# EAGLE design Pulsioximetro (EAGLE 6.4)
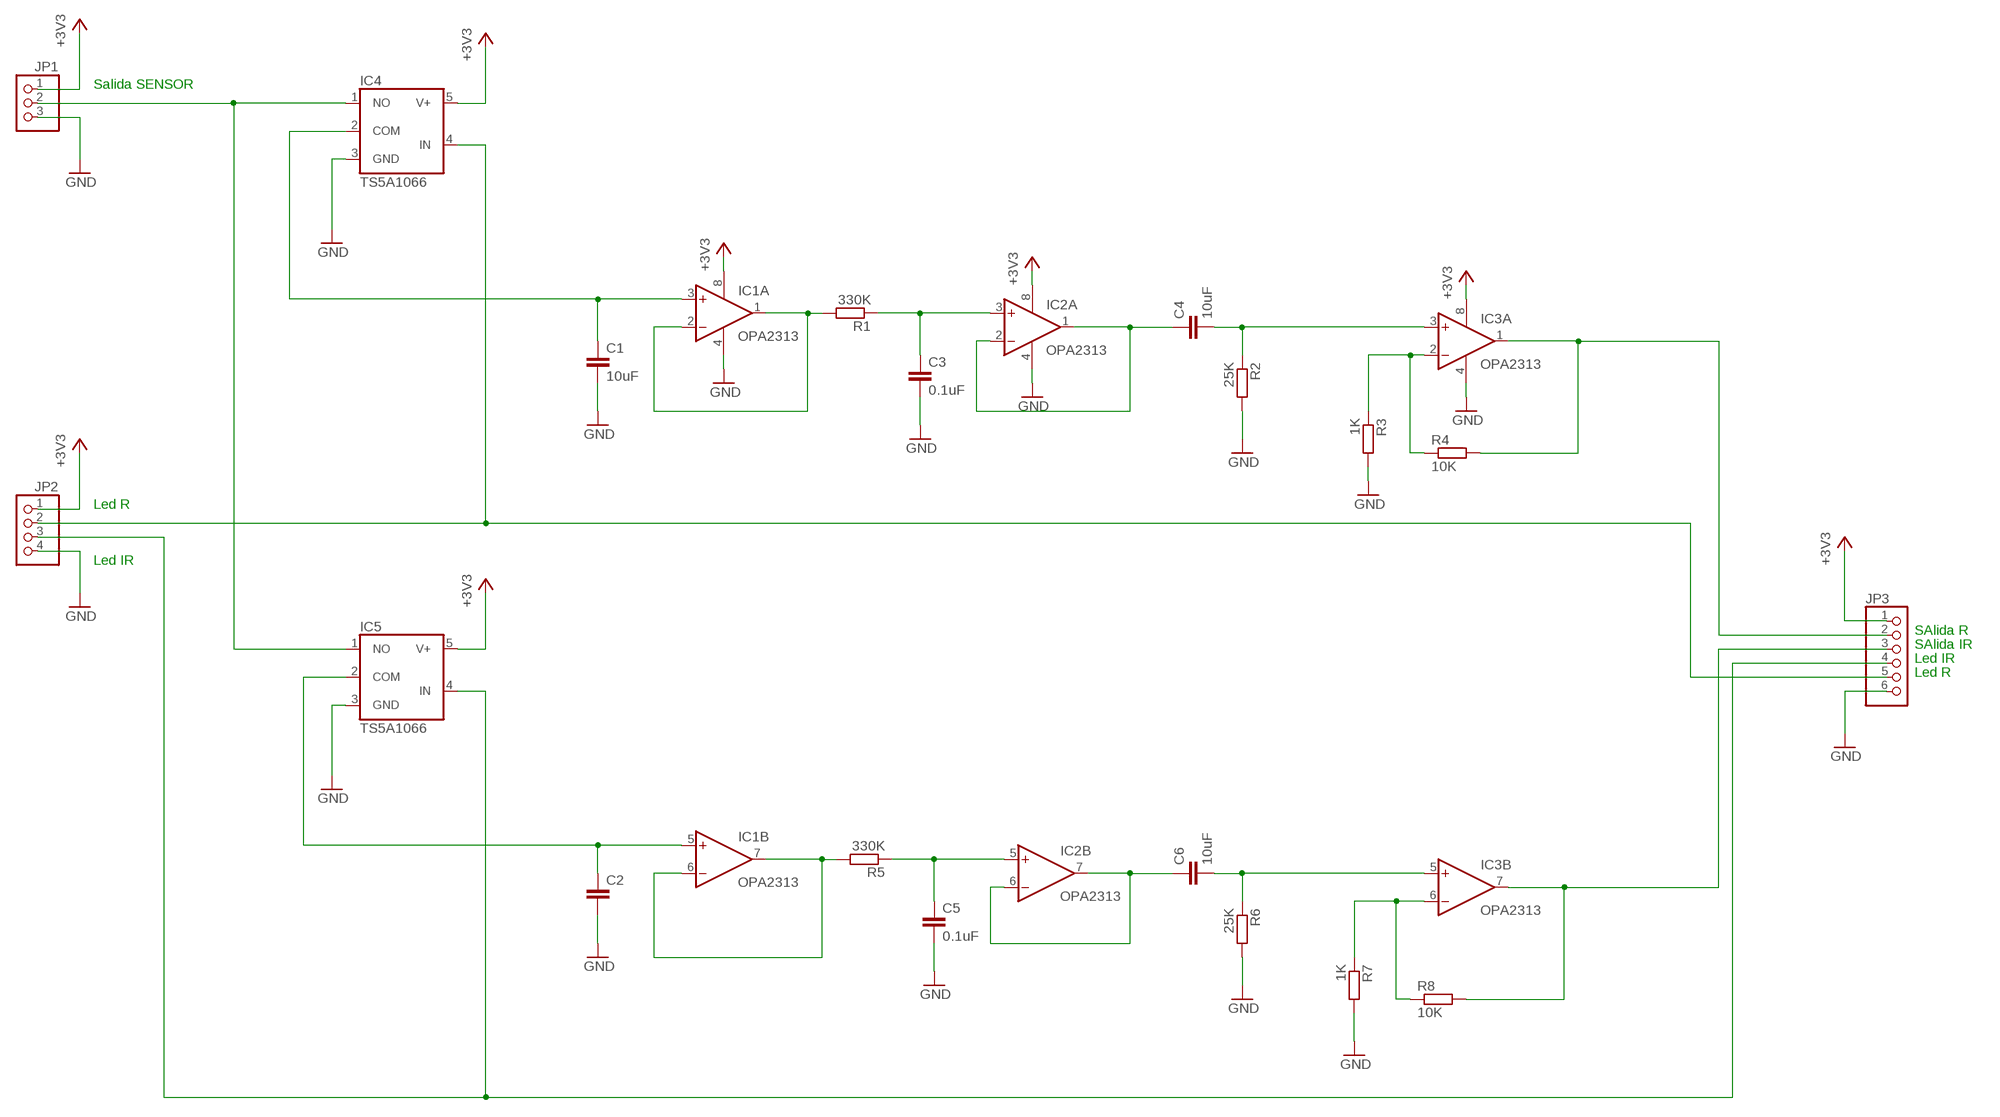
[diagram p0: schematic, sheet 1]

## Parts
C1  10uF  C-EU050-024X044  [C050-024X044]
C2  C-EU050-024X044  [C050-024X044]
C3  0.1uF  C-EU050-024X044  [C050-024X044]
C4  10uF  C-EU050-024X044  [C050-024X044]
C5  0.1uF  C-EU050-024X044  [C050-024X044]
C6  10uF  C-EU050-024X044  [C050-024X044]
IC1  OPA2313  TL082D  [SO08]
IC2  OPA2313  TL082D  [SO08]
IC3  OPA2313  TL082D  [SO08]
IC4  TS5A1066  TS520550  [SOT25]
IC5  TS5A1066  TS520550  [SOT25]
JP1  PINHD-1X3  [1X03]
JP2  PINHD-1X4  [1X04]
JP3  PINHD-1X6  [1X06]
R1  330K  R-EU_0207/10  [0207/10]
R2  25K  R-EU_0207/10  [0207/10]
R3  1K  R-EU_0207/10  [0207/10]
R4  10K  R-EU_0207/10  [0207/10]
R5  330K  R-EU_0207/10  [0207/10]
R6  25K  R-EU_0207/10  [0207/10]
R7  1K  R-EU_0207/10  [0207/10]
R8  10K  R-EU_0207/10  [0207/10]

## Nets
+3V3: IC1.8(P:V+) IC2.8(P:V+) IC3.8(P:V+) IC4.5(V+) IC5.5(V+) JP1.1 JP2.1 JP3.1
GND: C1.2 C2.2 C3.2 C5.2 IC1.4(P:V-) IC2.4(P:V-) IC3.4(P:V-) IC4.3(GND) IC5.3(GND) JP1.3 JP2.4 JP3.6 R2.2 R3.2 R6.2 R7.2
N$1: IC4.1(NO) IC5.1(NO) JP1.2
N$2: IC4.4(IN) JP2.2 JP3.5
N$3: IC5.4(IN) JP2.3 JP3.4
N$4: C1.1 IC1.3(A:+IN) IC4.2(COM)
N$5: C2.1 IC1.5(B:+IN) IC5.2(COM)
N$6: C3.1 IC2.3(A:+IN) R1.1
N$7: IC1.1(A:OUT) IC1.2(A:-IN) R1.2
N$9: C4.1 IC2.1(A:OUT) IC2.2(A:-IN)
N$10: C4.2 IC3.3(A:+IN) R2.1
N$11: IC3.2(A:-IN) R3.1 R4.1
N$12: IC3.1(A:OUT) JP3.2 R4.2
N$13: IC1.6(B:-IN) IC1.7(B:OUT) R5.2
N$14: C5.1 IC2.5(B:+IN) R5.1
N$16: C6.1 IC2.6(B:-IN) IC2.7(B:OUT)
N$18: C6.2 IC3.5(B:+IN) R6.1
N$19: IC3.6(B:-IN) R7.1 R8.1
N$20: IC3.7(B:OUT) JP3.3 R8.2

## Notes on the sheet
- Salida SENSOR
- Led R
- Led IR
- SAlida R
- SAlida IR
- Led IR
- Led R

## Library data of the parts
C1-C6 = rcl:C-EU: CAPACITOR, European symbol
IC1-IC3 = linear:TL082: OP AMP
IC4 IC5 = v-reg:TS5205: 150mA Low Noise LDO Voltage Regulator with Enable TSC [Taiwan Semiconductor Company, Ltd] Source: http://www.taiwansemi.com .. 5205_0409c.pdf
JP1 = pinhead:PINHD-1X3: PIN HEADER
JP2 = pinhead:PINHD-1X4: PIN HEADER
JP3 = pinhead:PINHD-1X6: PIN HEADER
R1-R8 = rcl:R-EU_: RESISTOR, European symbol

## Board
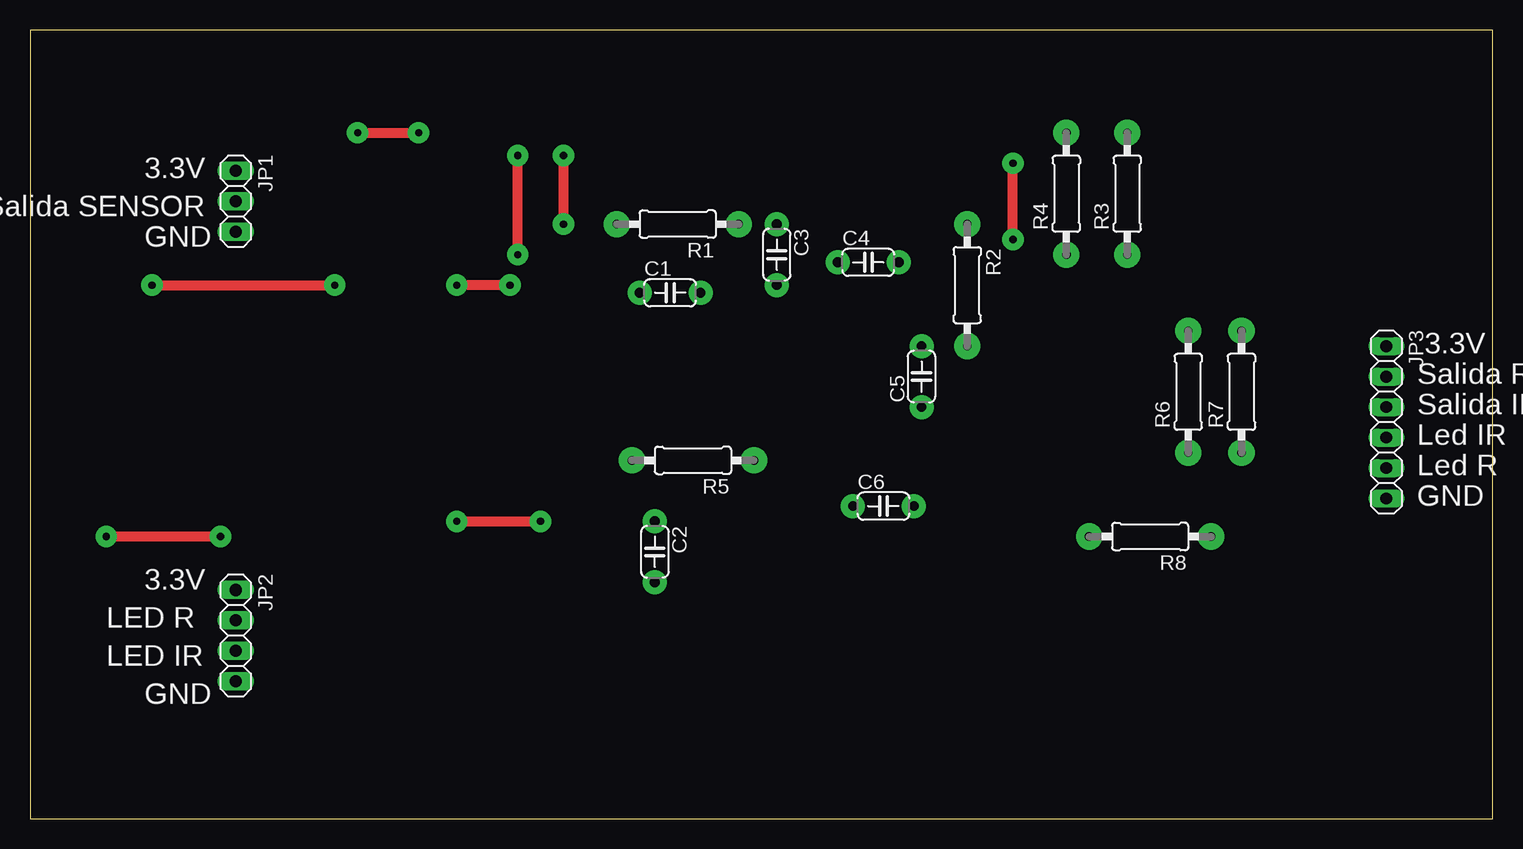
[diagram p1: board, top side]
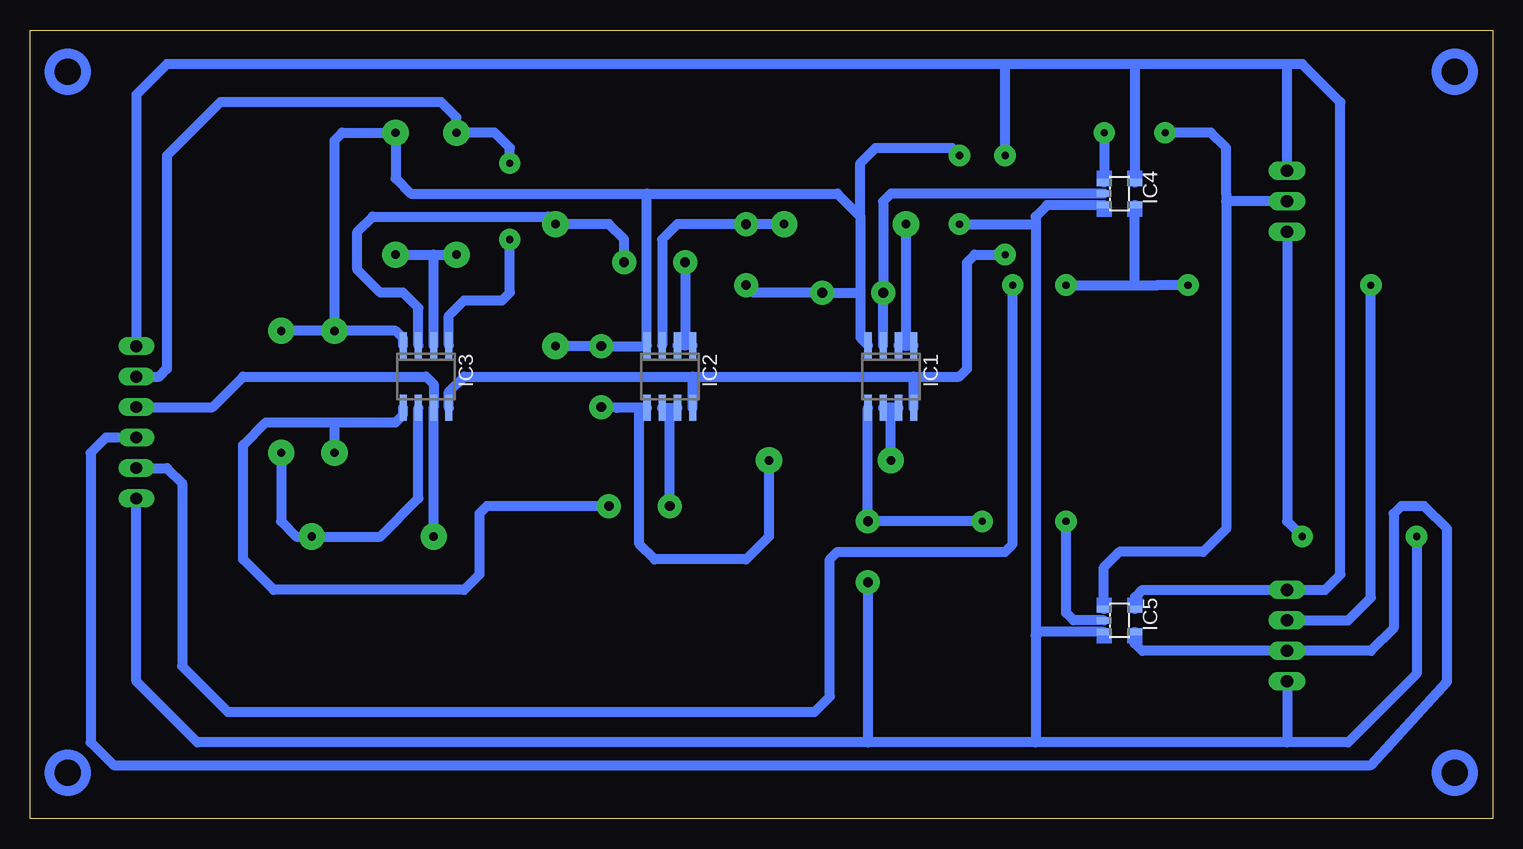
[diagram p2: board, bottom side, seen from below]

Size 121.9 x 65.71 mm. Coordinates in mm from the lower left corner, seen from the top.
Outline: 0,0 121.9,0 121.9,65.71 0,65.71 0,0
Copper layers (1*16): Top 0.035mm / dielectric 1.5mm / Bottom 0.035mm
Design rules "default": minimum track width 10mil, minimum drill 24mil, track to track 8mil, track to pad 8mil, pad to pad 8mil, via to via 8mil, smd to smd 8mil, copper to edge 40mil, drill to drill 8mil, minimum pad ring 10mil, minimum via ring 8mil, stop-mask expansion 4mil, vias tented up to drill 0mil, thermal gap 10mil

### Footprints (pad centres in the part's own frame; a part is rotated, then mirrored left to right if it is on the bottom)
C050-024X044 = drill 0.813 pad 2.007: 1 -2.54,0; 2 2.54,0
SO08 = smd 0.6 x 2.2: 1 -1.905,-2.6; 2 -0.635,-2.6; 3 0.635,-2.6; 4 1.905,-2.6; 5 1.905,2.6; 6 0.635,2.6; 7 -0.635,2.6; 8 -1.905,2.6
SOT25 = smd 0.55 x 1.2: 1 -0.95,-1.3; 2 0,-1.3; 3 0.95,-1.3; 4 0.95,1.3; 5 -0.95,1.3
1X03 = drill 1.016 long: 1 -2.54,0; 2 0,0; 3 2.54,0
1X04 = drill 1.016 long: 1 -3.81,0; 2 -1.27,0; 3 1.27,0; 4 3.81,0
1X06 = drill 0.991 long: 1 -6.35,0; 2 -3.81,0; 3 -1.27,0; 4 1.27,0; 5 3.81,0; 6 6.35,0
0207/10 = drill 0.7 pad 2.184: 1 -5.08,0; 2 5.08,0

### Placement (x,y rotation side)
C1  53.34,43.82 0 top
C2  52.07,22.23 270 top
C3  62.23,46.99 270 top
C4  69.85,46.36 0 top
C5  74.3,36.83 90 top
C6  71.12,26.04 0 top
IC1  50.16,36.83 180 bottom
IC2  68.58,36.83 180 bottom
IC3  88.9,36.83 180 bottom
IC4  31.11,52.07 270 bottom
IC5  31.11,16.51 270 bottom
JP1  17.14,51.44 270 top
JP2  17.14,15.24 270 top
JP3  113.03,33.02 270 top
R1  53.98,49.53 180 top
R2  78.11,44.45 270 top
R3  91.44,52.07 90 top
R4  86.36,52.07 90 top
R5  55.24,29.84 180 top
R6  96.52,35.56 90 top
R7  100.97,35.56 90 top
R8  93.34,23.5 180 top

### Tracks (layer width: path | path; a pad name or v marks a point on that pad's centre or on a via)
+3V3  (via drill 0.6 pad 1.78)
  Top 0.813: v40.64,46.99 v40.64,55.25
  Bottom 0.813: 17.14,62.87 15.88,62.87 12.7,59.69 12.7,20.32 13.97,19.05 JP2.1 29.21,19.05 29.82,18.45 IC5.5 | 17.14,62.87 29.84,62.87 | 29.84,62.87 40.64,62.87 | 40.64,62.87 110.49,62.87 113.03,60.33 JP3.1 | JP1.1 17.14,62.87 | IC4.5 29.82,62.84 29.84,62.87 | IC3.8 87,35.56 85.72,36.83 66.67,36.83 | 66.67,36.83 48.26,36.83 | IC2.8 66.67,36.83 | IC1.8 48.26,36.83 | 48.26,36.83 44.45,36.83 43.81,37.47 43.81,46.36 43.18,46.99 v40.64,46.99 | v40.64,55.25 40.64,62.87
GND  (via drill 0.6 pad 1.78)
  Top 0.813: v15.88,23.5 v6.35,23.5 | v44.45,55.25 v44.45,49.53
  Bottom 0.813: JP2.4 17.14,6.35 | 17.14,6.35 38.1,6.35 | 38.1,6.35 52.07,6.35 | 52.07,6.35 107.95,6.35 113.03,11.43 JP3.6 | JP1.3 17.14,24.77 v15.88,23.5 | v6.35,23.5 6.35,12.06 12.06,6.35 17.14,6.35 | IC4.3 37.15,51.12 38.1,50.16 38.1,49.53 | 38.1,49.53 38.1,15.24 | 38.1,15.24 38.1,6.35 | C2.2 52.07,6.35 | IC5.3 37.78,15.56 38.1,15.24 | 70.48,52.07 IC2.4 70.55,39.37 C5.2 R2.2 | 70.48,52.07 54.61,52.07 52.7,50.16 | 52.7,50.16 52.7,43.82 | 52.7,43.82 52.7,40.07 IC1.4 | 52.7,43.82 C1.2 61.59,43.82 C3.2 | R6.2 R7.2 | IC3.4 90.81,40.01 91.44,40.64 R6.2 | R6.2 96.52,56.52 95.89,57.15 R3.2 91.44,53.34 90.17,52.07 70.48,52.07 | 52.7,50.16 52.7,54.61 51.44,55.88 45.09,55.88 v44.45,55.25 | v44.45,49.53 38.1,49.53
N$1  (via drill 0.6 pad 1.78)
  Top 0.813: v27.3,57.15 v32.38,57.15
  Bottom 0.813: JP1.2 22.23,51.44 | v27.3,57.15 23.5,57.15 22.23,55.88 22.23,52.07 22.23,51.44 | v32.38,57.15 32.38,53.05 IC4.1 | IC5.1 32.41,20.93 31.11,22.23 24.13,22.23 22.23,24.13 22.23,51.44
N$2  (via drill 0.6 pad 1.78)
  Top 0.813: v10.16,44.45 v25.4,44.45 | v40.01,44.45 v35.56,44.45
  Bottom 0.813: JP2.2 12.06,16.51 10.16,18.41 v10.16,44.45 | v25.4,44.45 27.94,44.45 29.84,44.45 | 29.84,44.45 29.84,51.09 IC4.4 | JP3.5 110.49,29.21 109.22,27.94 109.22,12.7 105.41,8.89 56.52,8.89 55.24,10.16 55.24,21.59 54.61,22.23 40.64,22.23 40.01,22.86 v40.01,44.45 | v35.56,44.45 29.84,44.45
N$3
  Bottom 0.813: IC5.4 29.84,15.53 29.84,14.61 29.21,13.97 JP2.3 10.16,13.97 8.26,15.88 8.26,25.4 7.62,26.04 5.71,26.04 3.81,24.13 3.81,11.43 10.16,4.45 114.94,4.45 116.84,6.35 116.84,30.48 115.57,31.75 JP3.4
N$4
  Bottom 0.813: IC1.3 C1.1 50.8,51.44 50.16,52.07 IC4.2
N$5  (via drill 0.6 pad 1.78)
  Top 0.813: v35.56,24.77 v42.55,24.77
  Bottom 0.813: IC1.5 C2.1 v42.55,24.77 | IC5.2 34.92,16.51 35.56,17.15 v35.56,24.77
N$6
  Bottom 0.813: IC2.3 69.22,48.26 67.94,49.53 C3.1 R1.1
N$7
  Bottom 0.813: IC1.1 IC1.2 48.95,39.43 48.9,39.37 R1.2
N$9
  Bottom 0.813: IC2.1 67.31,39.43 | 67.31,39.43 IC2.2 | C4.1 67.31,39.43
N$10
  Bottom 0.813: C4.2 72.39,48.26 73.66,49.53 R2.1 78.74,50.16 93.34,50.16 94.61,48.9 94.61,45.72 92.71,43.82 90.81,43.82 89.53,42.55 IC3.3
N$11
  Bottom 0.813: IC3.2 88.27,46.99 | 88.27,46.99 R4.1 | R3.1 88.27,46.99
N$12  (via drill 0.6 pad 1.78)
  Top 0.813: v81.92,48.26 v81.92,54.61
  Bottom 0.813: JP3.2 111.12,36.83 110.49,37.47 110.49,55.25 106.05,59.69 87.63,59.69 86.36,58.42 R4.2 83.19,57.15 81.92,55.88 v81.92,54.61 | IC3.1 87,41.91 85.72,43.18 82.55,43.18 81.92,43.82 v81.92,48.26
N$13
  Bottom 0.813: IC1.7 50.16,34.23 | 50.16,34.23 IC1.6 | R5.2 50.16,34.23
N$14
  Bottom 0.813: IC2.5 71.12,34.23 | 71.12,34.23 72.97,34.23 C5.1 | R5.1 60.33,23.5 62.23,21.59 69.85,21.59 71.12,22.86 71.12,34.23
N$16
  Bottom 0.813: IC2.6 68.58,34.23 | 68.58,34.23 IC2.7 | C6.1 68.58,34.23
N$18
  Bottom 0.813: C6.2 83.82,26.04 84.45,25.4 84.45,20.32 85.72,19.05 101.6,19.05 104.14,21.59 104.14,31.12 102.23,33.02 96.52,33.02 | 96.52,33.02 91.44,33.02 90.81,33.66 IC3.5 | R6.1 96.52,33.02
N$19
  Bottom 0.813: IC3.6 89.53,26.67 92.71,23.5 R8.1 99.69,23.5 100.97,24.77 R7.1
N$20
  Bottom 0.813: R8.2 IC3.7 88.27,36.2 88.9,36.83 104.14,36.83 106.68,34.29 JP3.3
(copper drawn outside any net)
  shapes: Bottom area x8, Bottom circle x4

### Text on the board
tPlace: 3.3V | Salida SENSOR | GND | 3.3V | Salida R | Salida IR | Led IR | Led R | GND | 3.3V | LED R | LED IR | GND